# EasyEDA schematic Riden_Wi-Fi_V1.1.json
TITLE: Sheet_1; REV: 1.0; Date: 2025-01-01; Sheet: 1/1; Drawn By: 6420650A; Company: Your Company
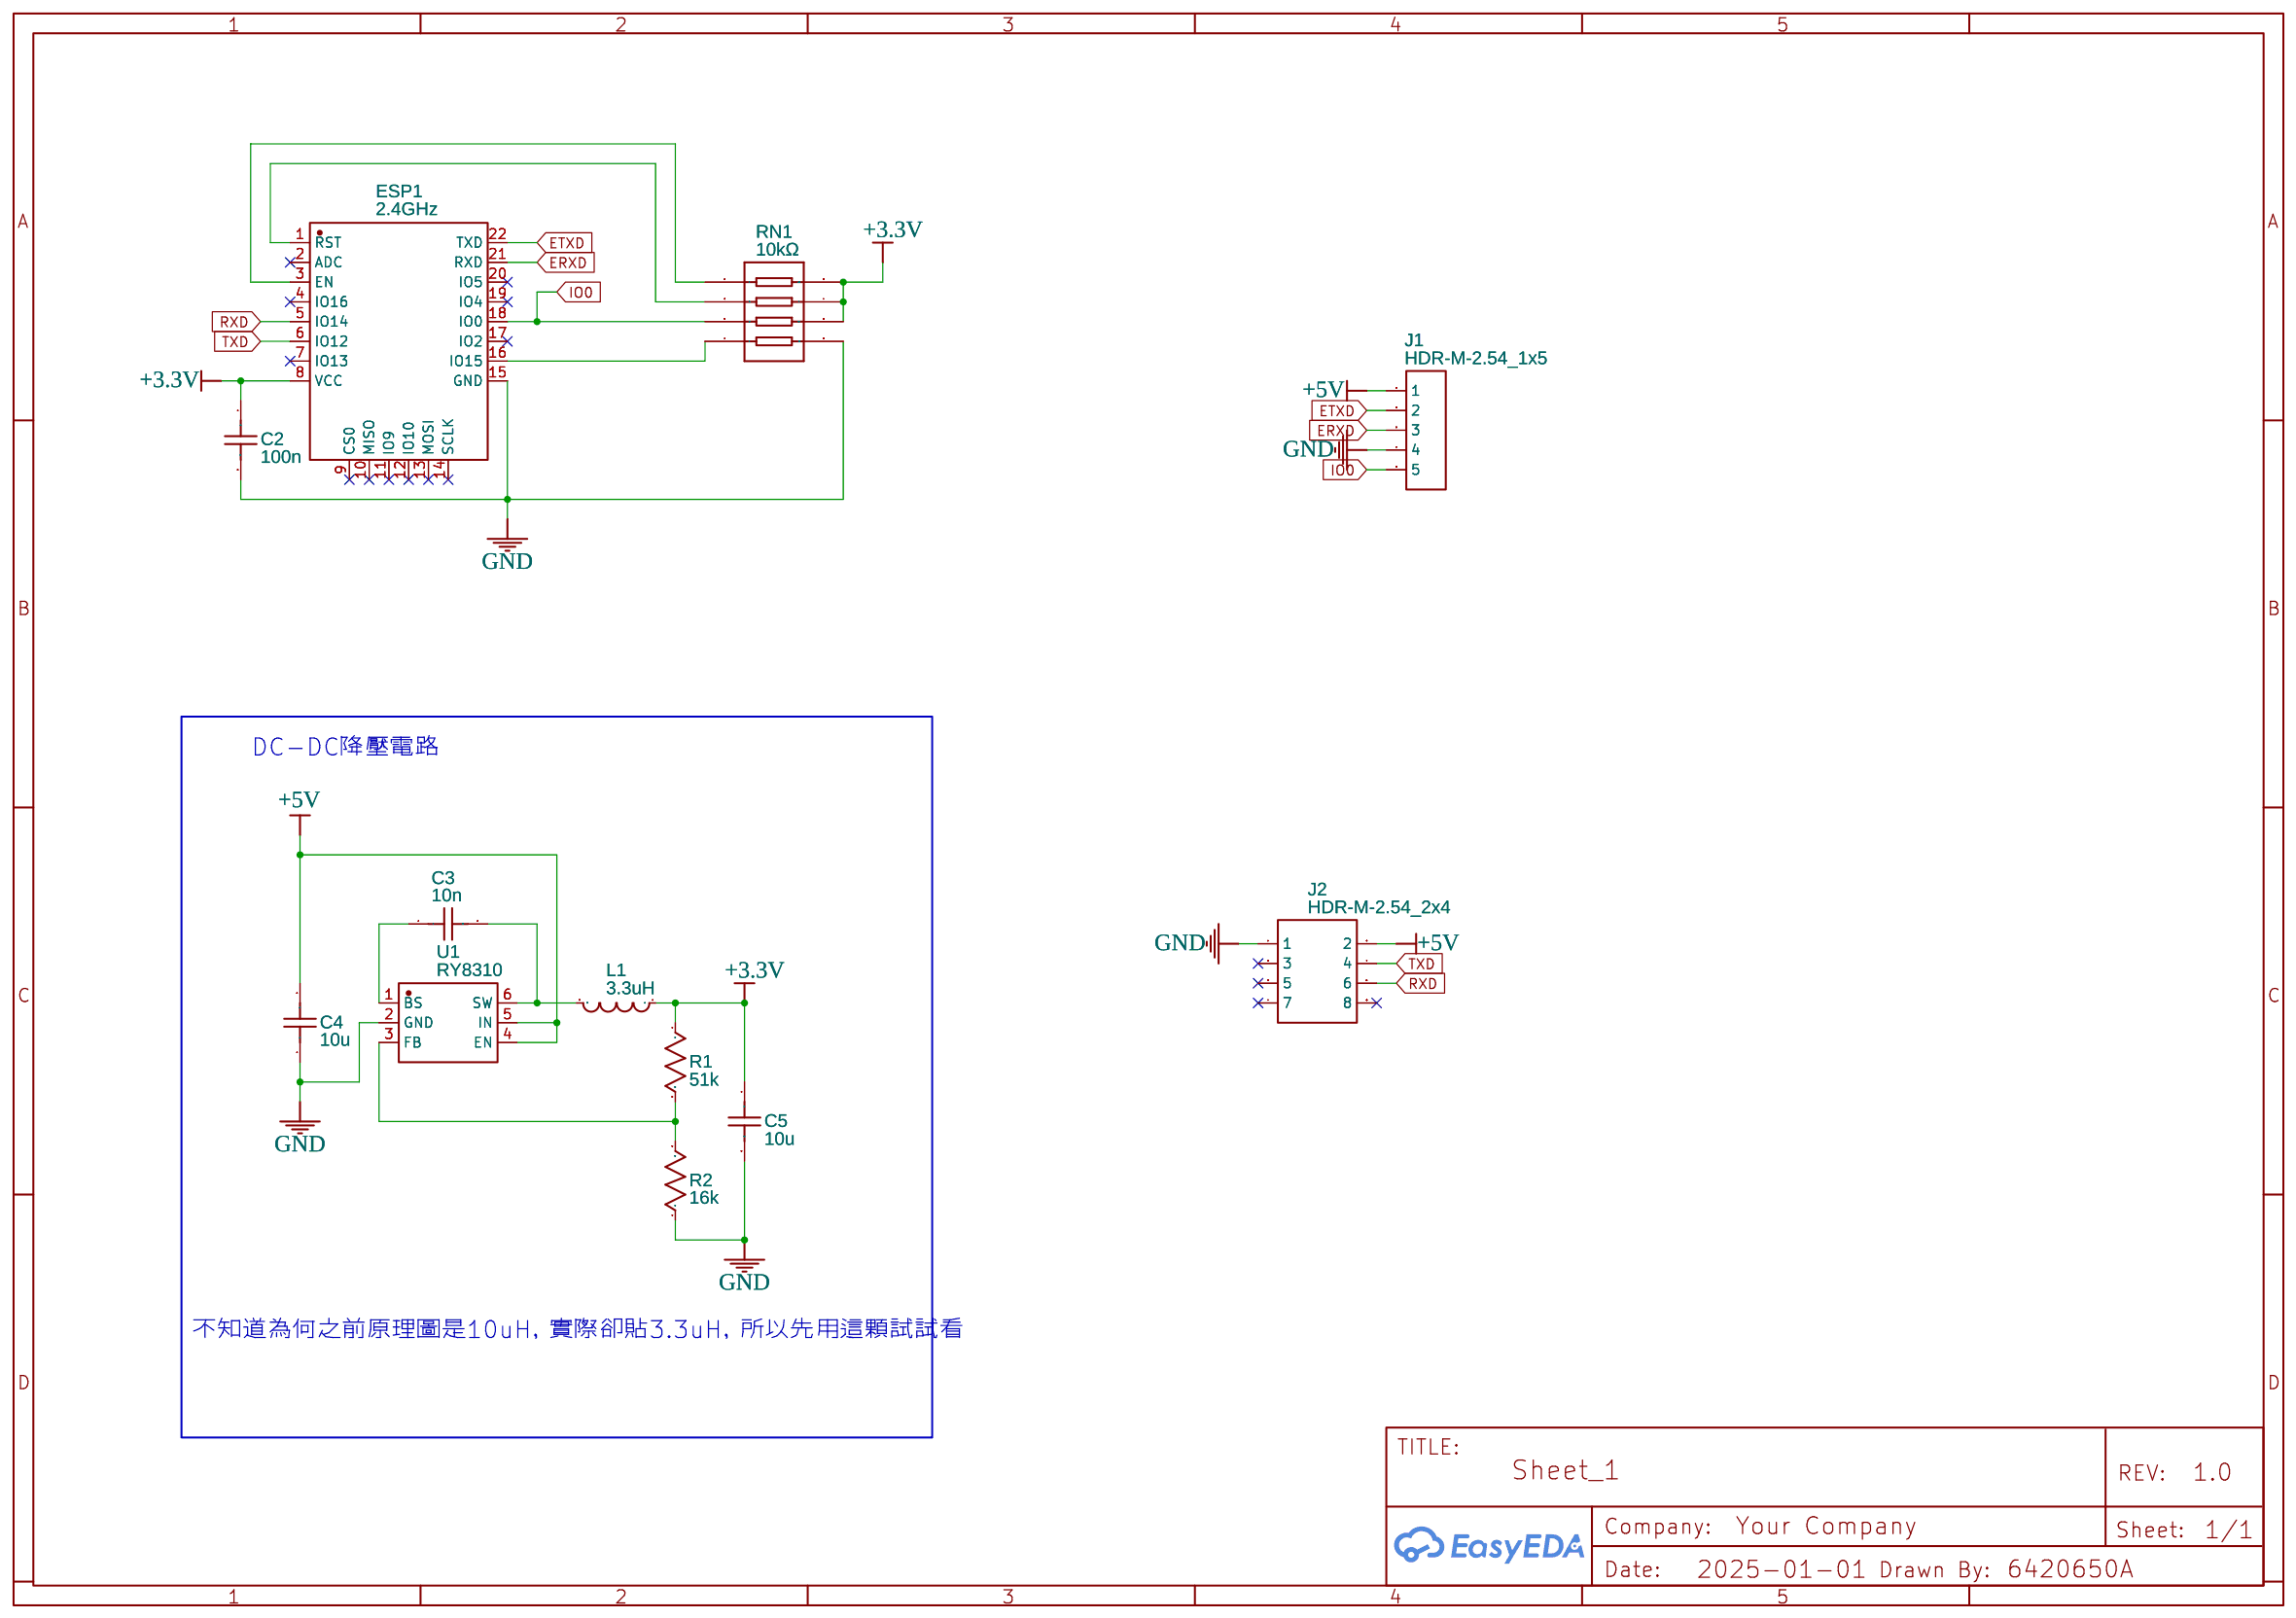
[diagram p0: schematic sheet]

## Parts
C2  100n  [C0603]
C3  10n  [C0603]
C4  10u  [C0603]
C5  10u  [C0603]
ESP1  2.4GHz  [ESP-12F]
J1  HDR-M-2.54_1x5  [HDR-M-2.54_1X5]
J2  HDR-M-2.54_2x4  [HDR-M-2.54_2X4]
L1  3.3uH  [L0806]
R1  51k  [R0603]
R2  16k  [R0603]
RN1  10kΩ  [RES-ARRAY-SMD_0603-8P-L3.2-W1.6-BL]
U1  RY8310  [SOT-23-6_L2.9-W1.6-P0.95-LS2.8-BL]

## Library data of the parts
C2-C5 = C_0603_US: Contributor: LCEDA_Lib
ESP1 = ESP-12F: Supplier: LCSC; Manufacturer: Ai-Thinker(安信可); Supplier Part: C82891; JLCPCB Part Class: Extended Part
J1 = HDR-M-2.54_1x5: Supplier Part: C358687; Supplier: LCSC; Contributor: LCEDA_Lib
J2 = HDR-M-2.54_2x4: Supplier Part: C58363; Supplier: LCSC; Contributor: LCEDA_Lib
L1 = 電感_0806: Contributor: lcsc; Supplier: LCSC; Supplier Part: C2049407; Manufacturer: ABRACON; Manufacturer Part: ASMPM-0806-3R3M-T; JLCPCB Part Class: Extended Part
R1 R2 = R_0603_US: Contributor: LCEDA_Lib
RN1 = 排組_0603_4D03WGJ0103T5E: Supplier: LCSC; Manufacturer: UNI-ROYAL(厚声); Manufacturer Part: 4D03WGJ0103T5E; Supplier Part: C29718; JLCPCB Part Class: Basic Part
U1 = RY8310: Contributor: LCSC; Supplier: LCSC; Supplier Part: C370876; Manufacturer: RYCHiP(蕊源); JLCPCB Part Class: Extended Part

## Nets
+3.3V: C2.1 C5.1 ESP1.8(VCC) L1.1 R1.1 RN1.6 RN1.7 RN1.8
+5V: C4.2 J1.1 J2.2 U1.4(EN) U1.5(IN)
GND: C2.2 C4.1 C5.2 ESP1.15(GND) J1.4 J2.1 R2.1 RN1.5 U1.2(GND)
ERXD: ESP1.21(RXD) J1.3
ETXD: ESP1.22(TXD) J1.2
IO0: ESP1.18(IO0) J1.5 RN1.3
RXD: ESP1.5(IO14) J2.6
TXD: ESP1.6(IO12) J2.4
Net-(C3-1): C3.1 U1.1(BS)
Net-(C3-2): C3.2 L1.2 U1.6(SW)
Net-(ESP1-1): ESP1.1(RST) RN1.2
Net-(ESP1-3): ESP1.3(EN) RN1.1
Net-(ESP1-16): ESP1.16(IO15) RN1.4
Net-(R1-2): R1.2 R2.2 U1.3(FB)

Not connected (* = marked no-connect by the designer): ESP1 2(ADC)* 4(IO16)* 7(IO13)* 9(CS0)* 10(MISO)* 11(IO9)* 12(IO10)* 13(MOSI)* 14(SCLK)* 17(IO2)* 19(IO4)* 20(IO5)*; J2 3* 5* 7* 8*

## Notes on the sheet
- DC-DC降壓電路
- 不知道為何之前原理圖是10uH，實際卻貼3.3uH，所以先用這顆試試看
